# EAGLE design prototype v2 (EAGLE 9.4.2)
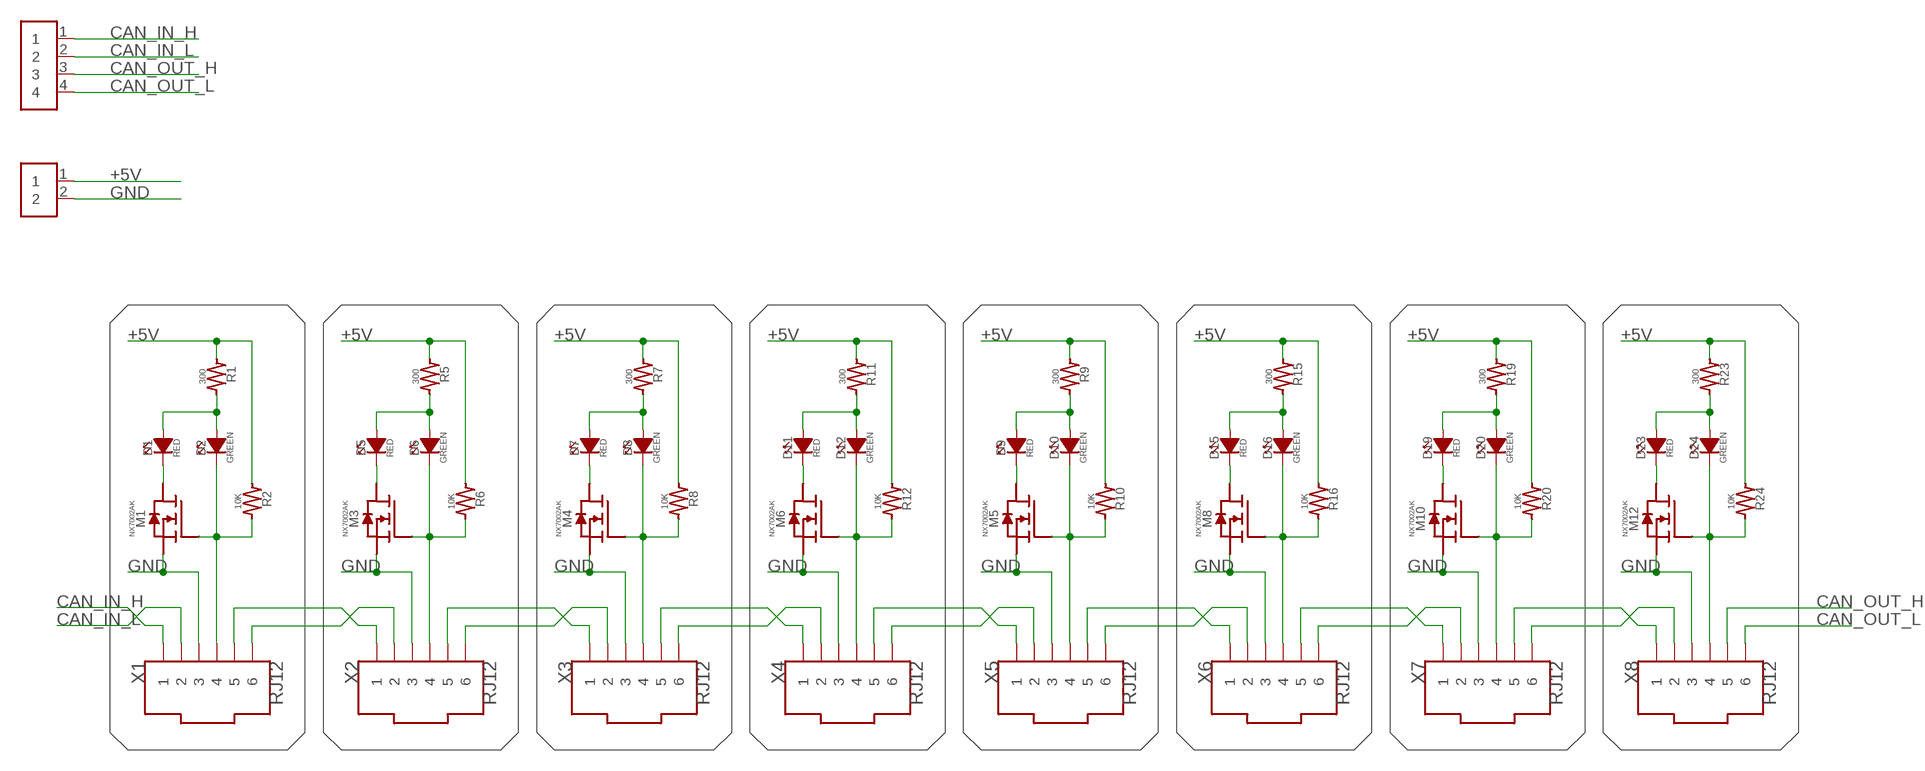
[diagram p0: schematic, sheet 1]

## Parts
D1  RED  LED  [0603-LED]
D2  GREEN  LED  [0603-LED]
D5  RED  LED  [0603-LED]
D6  GREEN  LED  [0603-LED]
D7  RED  LED  [0603-LED]
D8  GREEN  LED  [0603-LED]
D9  RED  LED  [0603-LED]
D10  GREEN  LED  [0603-LED]
D11  RED  LED  [0603-LED]
D12  GREEN  LED  [0603-LED]
D15  RED  LED  [0603-LED]
D16  GREEN  LED  [0603-LED]
D19  RED  LED  [0603-LED]
D20  GREEN  LED  [0603-LED]
D23  RED  LED  [0603-LED]
D24  GREEN  LED  [0603-LED]
M1  NX7002AK  N-FET  [SOT-23]
M3  NX7002AK  N-FET  [SOT-23]
M4  NX7002AK  N-FET  [SOT-23]
M5  NX7002AK  N-FET  [SOT-23]
M6  NX7002AK  N-FET  [SOT-23]
M8  NX7002AK  N-FET  [SOT-23]
M10  NX7002AK  N-FET  [SOT-23]
M12  NX7002AK  N-FET  [SOT-23]
R1  300  RESISTOR0603  [0603]
R2  10K  RESISTOR0603  [0603]
R5  300  RESISTOR0603  [0603]
R6  10K  RESISTOR0603  [0603]
R7  300  RESISTOR0603  [0603]
R8  10K  RESISTOR0603  [0603]
R9  300  RESISTOR0603  [0603]
R10  10K  RESISTOR0603  [0603]
R11  300  RESISTOR0603  [0603]
R12  10K  RESISTOR0603  [0603]
R15  300  RESISTOR0603  [0603]
R16  10K  RESISTOR0603  [0603]
R19  300  RESISTOR0603  [0603]
R20  10K  RESISTOR0603  [0603]
R23  300  RESISTOR0603  [0603]
R24  10K  RESISTOR0603  [0603]
U$1  TERMINAL_BLOCK  [TERMINALBLOCK-4]
U$2  POWER_BLOCK  [TERMINALBLOCK-2]
X1  RJ12  [RJ12]
X2  RJ12  [RJ12]
X3  RJ12  [RJ12]
X4  RJ12  [RJ12]
X5  RJ12  [RJ12]
X6  RJ12  [RJ12]
X7  RJ12  [RJ12]
X8  RJ12  [RJ12]

## Nets
+5V: R1.1 R2.1 R5.1 R6.1 R7.1 R8.1 R9.1 R10.1 R11.1 R12.1 R15.1 R16.1 R19.1 R20.1 R23.1 R24.1 U$2.1
CAN_IN_H: U$1.1 X1.1
CAN_IN_L: U$1.2 X1.2
CAN_OUT_H: U$1.3 X8.5
CAN_OUT_L: U$1.4 X8.6
GND: M1.2(SOURCE) M3.2(SOURCE) M4.2(SOURCE) M5.2(SOURCE) M6.2(SOURCE) M8.2(SOURCE) M10.2(SOURCE) M12.2(SOURCE) U$2.2 X1.3 X2.3 X3.3 X4.3 X5.3 X6.3 X7.3 X8.3
N$1: D1.1(-) M1.3(DRAIN)
N$2: D2.1(-) M1.1(GATE) R2.2 X1.4
N$4: D1.2(+) D2.2(+) R1.2
N$7: X1.5 X2.1
N$8: X1.6 X2.2
N$15: D5.1(-) M3.3(DRAIN)
N$16: D6.1(-) M3.1(GATE) R6.2 X2.4
N$17: D5.2(+) D6.2(+) R5.2
N$18: X2.5 X3.1
N$19: X2.6 X3.2
N$20: D9.1(-) M5.3(DRAIN)
N$21: D10.1(-) M5.1(GATE) R10.2 X5.4
N$22: D7.1(-) M4.3(DRAIN)
N$23: D8.1(-) M4.1(GATE) R8.2 X3.4
N$24: D7.2(+) D8.2(+) R7.2
N$25: X3.5 X4.1
N$26: X3.6 X4.2
N$27: D9.2(+) D10.2(+) R9.2
N$28: X5.5 X6.1
N$29: X5.6 X6.2
N$31: X4.6 X5.2
N$36: D11.1(-) M6.3(DRAIN)
N$37: D12.1(-) M6.1(GATE) R12.2 X4.4
N$38: D11.2(+) D12.2(+) R11.2
N$39: X4.5 X5.1
N$44: D15.1(-) M8.3(DRAIN)
N$45: D16.1(-) M8.1(GATE) R16.2 X6.4
N$46: D15.2(+) D16.2(+) R15.2
N$47: X6.5 X7.1
N$48: X6.6 X7.2
N$58: D19.1(-) M10.3(DRAIN)
N$59: D20.1(-) M10.1(GATE) R20.2 X7.4
N$60: D19.2(+) D20.2(+) R19.2
N$61: X7.5 X8.1
N$62: X7.6 X8.2
N$72: D23.1(-) M12.3(DRAIN)
N$73: D24.1(-) M12.1(GATE) R24.2 X8.4
N$74: D23.2(+) D24.2(+) R23.2

## Library data of the parts
D1 D2 D5-D12 D15 D16 D19 D20 D23 D24 = components:LED
M1 M3-M6 M8 M10 M12 = components:N-FET
R1 R2 R5-R12 R15 R16 R19 R20 R23 R24 = components:RESISTOR
U$1 = components:TERMINAL_BLOCK
U$2 = components:POWER_BLOCK
X1-X8 = components:RJ12

## Board
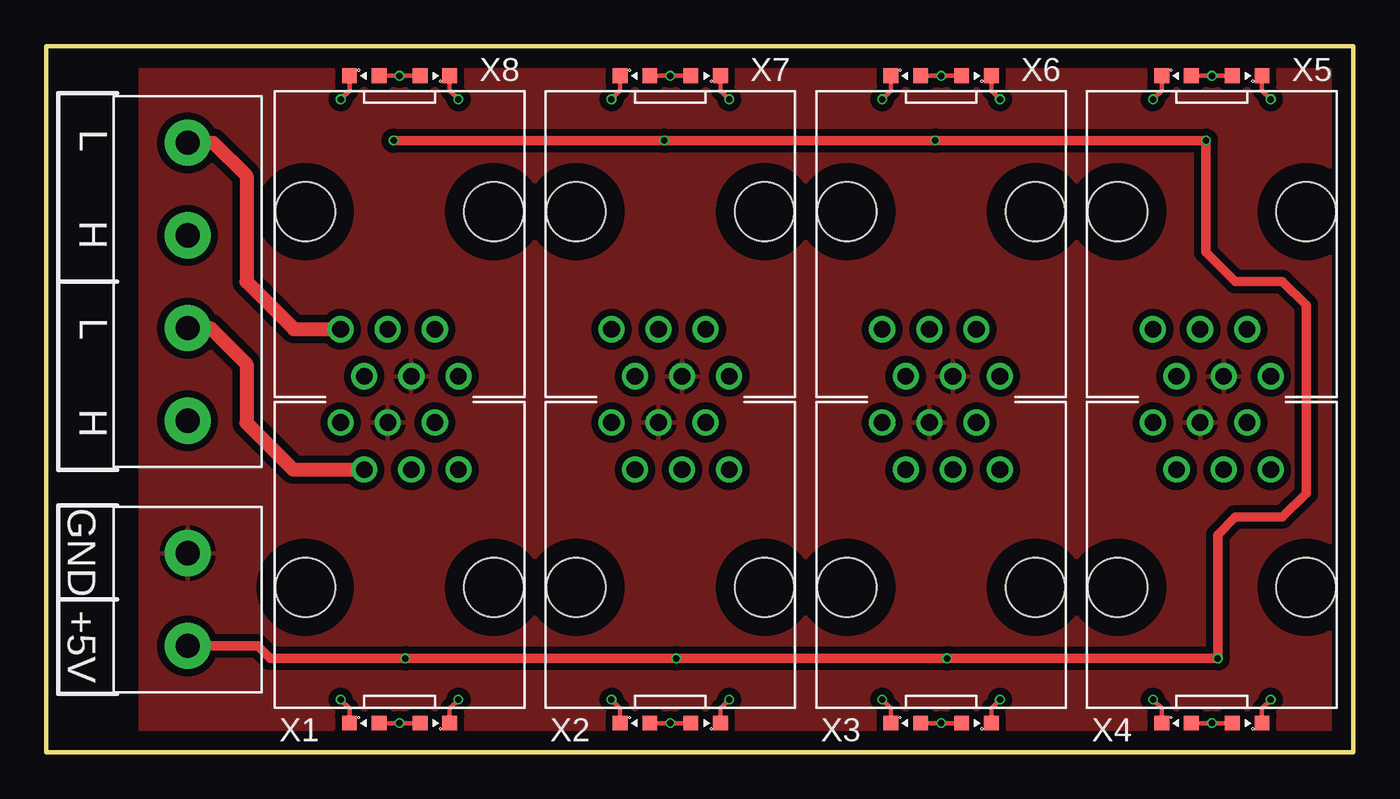
[diagram p1: board, top side]
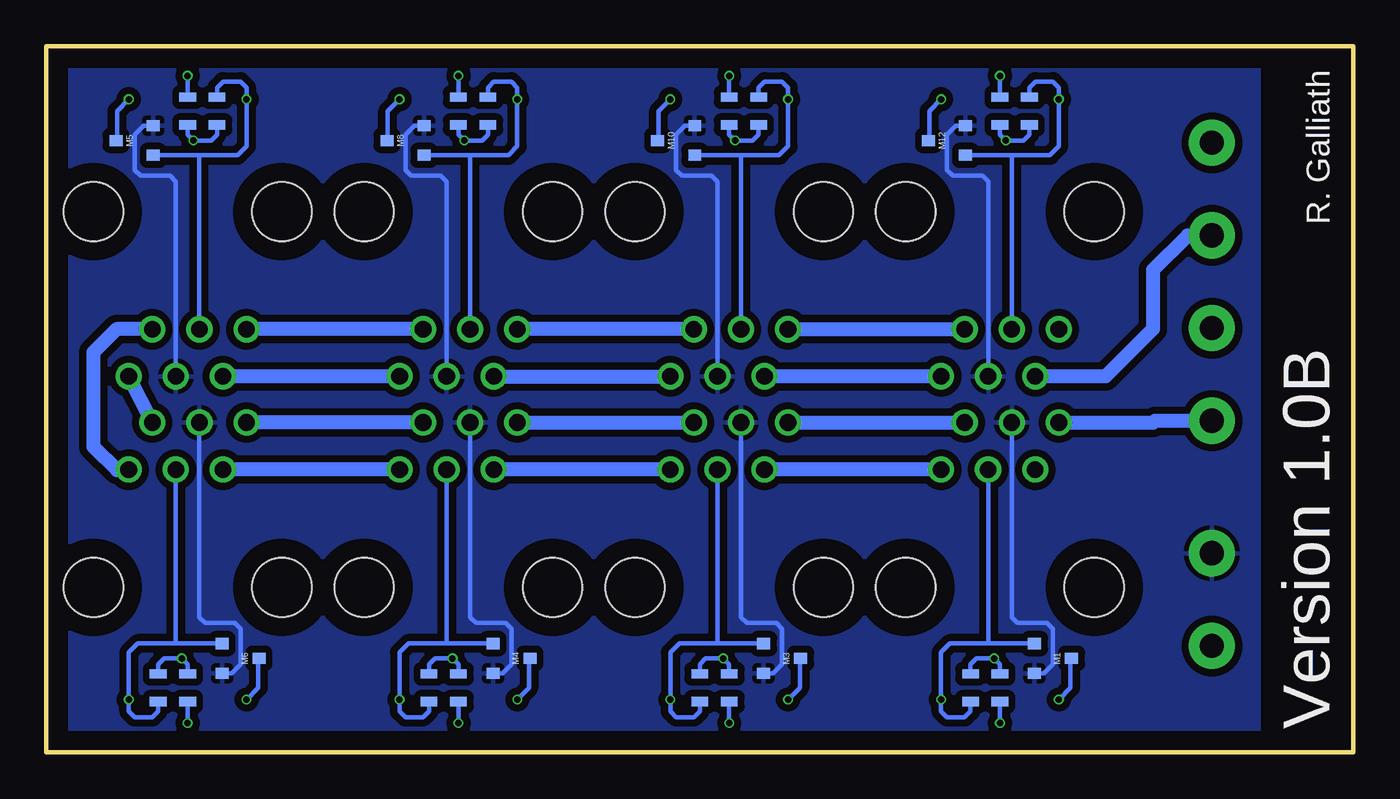
[diagram p2: board, bottom side, seen from below]

Size 70.48 x 38.1 mm. Coordinates in mm from the lower left corner, seen from the top.
Outline: 0,0 0,38.1 70.48,38.1 70.48,0 0,0
Copper layers (1*16): Top 0.035mm / dielectric 1.5mm / Bottom 0.035mm
Design rules "default *": minimum track width 6mil, minimum drill 0.35mm, track to track 6mil, track to pad 6mil, pad to pad 6mil, via to via 6mil, smd to smd 6mil, copper to edge 40mil, drill to drill 6mil, minimum pad ring 10mil, minimum via ring 1mil, stop-mask expansion 4mil, vias tented up to drill 15mil, thermal gap 10mil

### Footprints (pad centres in the part's own frame; a part is rotated, then mirrored left to right if it is on the bottom)
0603-LED = smd 0.8 x 0.8: 1 -0.8,0; 2 0.8,0
SOT-23 = smd 0.6 x 0.7: 1 -0.8,-1; 2 0.8,-1; 3 0,1
0603 = smd 0.5 x 0.9: 1 -0.75,0; 2 0.75,0
TERMINALBLOCK-4 = drill 1.3 pad 2.5: 1 -7.5,0; 2 -2.5,0; 3 2.5,0; 4 7.5,0
TERMINALBLOCK-2 = drill 1.3 pad 2.5: 1 -2.5,0; 2 2.5,0
RJ12 = drill 0.9: 1 3.175,-15.39; 2 1.905,-12.85; 3 0.635,-15.39; 4 -0.635,-12.85; 5 -1.905,-15.39; 6 -3.175,-12.85 | hole 3.2: -5.08,-6.5; 5.08,-6.5

### Placement (x,y rotation side)
D1  17.14,1.59 0 top
D2  20.95,1.59 180 top
D5  31.75,1.59 0 top
D6  35.56,1.59 180 top
D7  46.35,1.59 0 top
D8  50.16,1.59 180 top
D9  64.77,36.51 180 top
D10  60.96,36.51 0 top
D11  60.96,1.59 0 top
D12  64.77,1.59 180 top
D15  50.16,36.51 180 top
D16  46.35,36.51 0 top
D19  35.56,36.51 180 top
D20  31.75,36.51 0 top
D23  20.95,36.51 180 top
D24  17.14,36.51 0 top
M1  16.19,5.08 270 bottom
M3  30.8,5.08 270 bottom
M4  45.4,5.08 270 bottom
M5  65.72,33.02 90 bottom
M6  60.01,5.08 270 bottom
M8  51.12,33.02 90 bottom
M10  36.51,33.02 90 bottom
M12  21.91,33.02 90 bottom
R1  19.05,3.49 270 bottom
R2  20.64,3.49 270 bottom
R5  33.66,3.49 270 bottom
R6  35.24,3.49 270 bottom
R7  48.26,3.49 270 bottom
R8  49.85,3.49 270 bottom
R9  62.87,34.61 90 bottom
R10  61.28,34.61 90 bottom
R11  62.87,3.49 270 bottom
R12  64.45,3.49 270 bottom
R15  48.26,34.61 90 bottom
R16  46.67,34.61 90 bottom
R19  33.66,34.61 90 bottom
R20  32.07,34.61 90 bottom
R23  19.05,34.61 90 bottom
R24  17.46,34.61 90 bottom
U$1  7.62,25.4 90 top
U$2  7.62,8.26 90 top
X1  19.05,2.41 180 top
X2  33.66,2.41 180 top
X3  48.26,2.41 180 top
X4  62.87,2.41 180 top
X5  62.87,35.69 0 top
X6  48.26,35.69 0 top
X7  33.66,35.69 0 top
X8  19.05,35.69 0 top

### Tracks (layer width: path | path; a pad name or v marks a point on that pad's centre or on a via)
+5V  (via drill 0.35)
  Top 0.508: v18.73,33.02 v33.34,33.02 v47.94,33.02 v62.55,33.02 62.55,26.99 64.14,25.4 66.67,25.4 67.94,24.13 67.94,13.97 66.67,12.7 64.14,12.7 63.18,11.75 v63.18,5.08 v48.58,5.08 v33.97,5.08 v19.37,5.08 12.06,5.08 11.39,5.75 U$2.1
  Bottom 0.254: R1.1 19.05,4.76 v19.37,5.08 20.32,5.08 20.64,4.76 R2.1 | R5.1 33.66,4.76 v33.97,5.08 34.92,5.08 35.24,4.76 R6.1 | R7.1 48.26,4.76 v48.58,5.08 49.53,5.08 49.85,4.76 R8.1 | R11.1 62.87,4.76 v63.18,5.08 64.14,5.08 64.45,4.76 R12.1 | R9.1 62.87,33.34 v62.55,33.02 61.59,33.02 61.28,33.34 R10.1 | R15.1 48.26,33.34 v47.94,33.02 46.99,33.02 46.67,33.34 R16.1 | R19.1 33.66,33.34 v33.34,33.02 32.38,33.02 32.07,33.34 R20.1 | R23.1 19.05,33.34 v18.73,33.02 17.78,33.02 17.46,33.34 R24.1
CAN_IN_H
  Bottom 0.762: 7.65,17.93 U$1.1 10.68,17.9 10.79,17.78 15.85,17.78 X1.1
CAN_IN_L
  Top 0.762: U$1.2 8.85,22.9 10.79,20.95 10.79,17.78 13.31,15.26 X1.2
CAN_OUT_H
  Bottom 0.762: U$1.3 8.93,27.9 10.79,26.04 10.79,22.86 13.36,20.3 X8.5
CAN_OUT_L
  Top 0.762: U$1.4 9.01,32.9 10.79,31.11 10.79,25.4 13.36,22.84 X8.6
GND
  Bottom 0.254: X1.3 18.41,7.3 18.1,6.99 16.51,6.99 16.19,6.67 16.19,4.76 16.68,4.28 M1.2 | X2.3 33.02,7.3 32.7,6.99 31.11,6.99 30.8,6.67 30.8,4.76 31.28,4.28 M3.2 | X3.3 47.62,7.3 47.31,6.99 45.72,6.99 45.4,6.67 45.4,4.76 45.88,4.28 M4.2 | X4.3 62.23,7.3 61.91,6.99 60.33,6.99 60.01,6.67 60.01,4.76 60.49,4.28 M6.2 | X5.3 63.5,30.8 63.82,31.11 65.41,31.11 65.72,31.43 65.72,33.34 65.24,33.82 M5.2 | X6.3 48.9,30.8 49.21,31.11 50.8,31.11 51.12,31.43 51.12,33.34 50.63,33.82 M8.2 | X7.3 34.29,30.8 34.61,31.11 36.2,31.11 36.51,31.43 36.51,33.34 36.03,33.82 M10.2 | X8.3 19.68,30.8 20,31.11 21.59,31.11 21.91,31.43 21.91,33.34 21.43,33.82 M12.2
  pour Top (isolate 0.381): 5.08,37.47 5.08,0.64 69.22,0.64 69.22,37.47
  pour Bottom (isolate 0.381): 5.08,37.47 5.08,0.64 69.22,0.64 69.22,37.47
N$1  (via drill 0.35)
  Top 0.254: D1.1 16.34,2.39 v15.88,2.86
  Bottom 0.254: M1.3 15.24,5.03 15.24,3.49 v15.88,2.86
N$2  (via drill 0.35)
  Top 0.254: D2.1 21.75,2.39 v22.23,2.86
  Bottom 0.254: R2.2 20.64,2.22 20.95,1.91 21.91,1.91 22.23,2.22 v22.23,2.86 22.23,5.4 21.74,5.88 19.68,5.88 | M1.1 19.68,5.88 | X1.4 19.68,5.88
N$4  (via drill 0.35)
  Top 0.254: D1.2 v19.05,1.59 D2.2
  Bottom 0.254: R1.2 v19.05,1.59
N$7
  Bottom 0.762: X2.1 X1.5
N$8
  Bottom 0.762: X1.6 X2.2
N$15  (via drill 0.35)
  Top 0.254: D5.1 30.95,2.39 v30.48,2.86
  Bottom 0.254: M3.3 29.84,5.03 29.84,3.49 v30.48,2.86
N$16  (via drill 0.35)
  Top 0.254: D6.1 36.36,2.39 v36.83,2.86
  Bottom 0.254: R6.2 35.24,2.22 35.56,1.91 36.51,1.91 36.83,2.22 v36.83,2.86 36.83,5.4 36.35,5.88 34.29,5.88 | M3.1 34.29,5.88 | X2.4 34.29,5.88
N$17  (via drill 0.35)
  Top 0.254: D5.2 v33.66,1.59 D6.2
  Bottom 0.254: R5.2 v33.66,1.59
N$18
  Bottom 0.762: X3.1 X2.5
N$19
  Bottom 0.762: X2.6 X3.2
N$20  (via drill 0.35)
  Top 0.254: D9.1 65.57,35.71 v66.04,35.24
  Bottom 0.254: M5.3 66.67,33.07 66.67,34.61 v66.04,35.24
N$21  (via drill 0.35)
  Top 0.254: D10.1 60.16,35.71 v59.69,35.24
  Bottom 0.254: R10.2 61.28,35.88 60.96,36.2 60.01,36.2 59.69,35.88 v59.69,35.24 59.69,32.7 60.17,32.22 62.23,32.22 | M5.1 62.23,32.22 | X5.4 62.23,32.22
N$22  (via drill 0.35)
  Top 0.254: D7.1 45.55,2.39 v45.09,2.86
  Bottom 0.254: M4.3 44.45,5.03 44.45,3.49 v45.09,2.86
N$23  (via drill 0.35)
  Top 0.254: D8.1 50.97,2.39 v51.44,2.86
  Bottom 0.254: R8.2 49.85,2.22 50.16,1.91 51.12,1.91 51.44,2.22 v51.44,2.86 51.44,5.4 50.95,5.88 48.9,5.88 | M4.1 48.9,5.88 | X3.4 48.9,5.88
N$24  (via drill 0.35)
  Top 0.254: D7.2 v48.26,1.59 D8.2
  Bottom 0.254: R7.2 v48.26,1.59
N$25
  Bottom 0.762: X3.5 X4.1
N$26
  Bottom 0.762: X3.6 X4.2
N$27  (via drill 0.35)
  Top 0.254: D9.2 v62.87,36.51 D10.2
  Bottom 0.254: R9.2 v62.87,36.51
N$28
  Bottom 0.762: X6.1 X5.5
N$29
  Bottom 0.762: X6.2 X5.6
N$31
  Bottom 0.762: X5.2 66.7,22.84 67.94,21.59 67.94,16.51 66.67,15.24 66.06,15.24 X4.6
N$36  (via drill 0.35)
  Top 0.254: D11.1 60.16,2.39 v59.69,2.86
  Bottom 0.254: M6.3 59.05,5.03 59.05,3.49 v59.69,2.86
N$37  (via drill 0.35)
  Top 0.254: D12.1 65.57,2.39 v66.04,2.86
  Bottom 0.254: R12.2 64.45,2.22 64.77,1.91 65.72,1.91 66.04,2.22 v66.04,2.86 66.04,5.4 65.56,5.88 63.5,5.88 | M6.1 63.5,5.88 | X4.4 63.5,5.88
N$38  (via drill 0.35)
  Top 0.254: D11.2 v62.87,1.59 D12.2
  Bottom 0.254: R11.2 v62.87,1.59
N$39
  Bottom 0.762: X4.5 X5.1
N$44  (via drill 0.35)
  Top 0.254: D15.1 50.97,35.71 v51.44,35.24
  Bottom 0.254: M8.3 52.07,33.07 52.07,34.61 v51.44,35.24
N$45  (via drill 0.35)
  Top 0.254: D16.1 45.55,35.71 v45.09,35.24
  Bottom 0.254: R16.2 46.67,35.88 46.35,36.2 45.4,36.2 45.09,35.88 v45.09,35.24 45.09,32.7 45.57,32.22 47.62,32.22 | M8.1 47.62,32.22 | X6.4 47.62,32.22
N$46  (via drill 0.35)
  Top 0.254: D15.2 v48.26,36.51 D16.2
  Bottom 0.254: R15.2 v48.26,36.51
N$47
  Bottom 0.762: X6.5 X7.1
N$48
  Bottom 0.762: X7.2 X6.6
N$58  (via drill 0.35)
  Top 0.254: D19.1 36.36,35.71 v36.83,35.24
  Bottom 0.254: M10.3 37.47,33.07 37.47,34.61 v36.83,35.24
N$59  (via drill 0.35)
  Top 0.254: D20.1 30.95,35.71 v30.48,35.24
  Bottom 0.254: R20.2 32.07,35.88 31.75,36.2 30.8,36.2 30.48,35.88 v30.48,35.24 30.48,32.7 30.96,32.22 33.02,32.22 | M10.1 33.02,32.22 | X7.4 33.02,32.22
N$60  (via drill 0.35)
  Top 0.254: D19.2 v33.66,36.51 D20.2
  Bottom 0.254: R19.2 v33.66,36.51
N$61
  Bottom 0.762: X8.1 X7.5
N$62
  Bottom 0.762: X7.6 X8.2
N$72  (via drill 0.35)
  Top 0.254: D23.1 21.75,35.71 v22.23,35.24
  Bottom 0.254: M12.3 22.86,33.07 22.86,34.61 v22.23,35.24
N$73  (via drill 0.35)
  Top 0.254: D24.1 16.34,35.71 v15.88,35.24
  Bottom 0.254: R24.2 17.46,35.88 17.14,36.2 16.19,36.2 15.88,35.88 v15.88,35.24 15.88,32.7 16.36,32.22 18.41,32.22 | M12.1 18.41,32.22 | X8.4 18.41,32.22
N$74  (via drill 0.35)
  Top 0.254: D23.2 v19.05,36.51 D24.2
  Bottom 0.254: R23.2 v19.05,36.51

### Text on the board
tPlace: L | H | L | H | GND | +5V
bPlace: R. Galliath | Version 1.0B